# EAGLE design Lipo 18650 Boost Charge Protect (EAGLE 8.6.1)
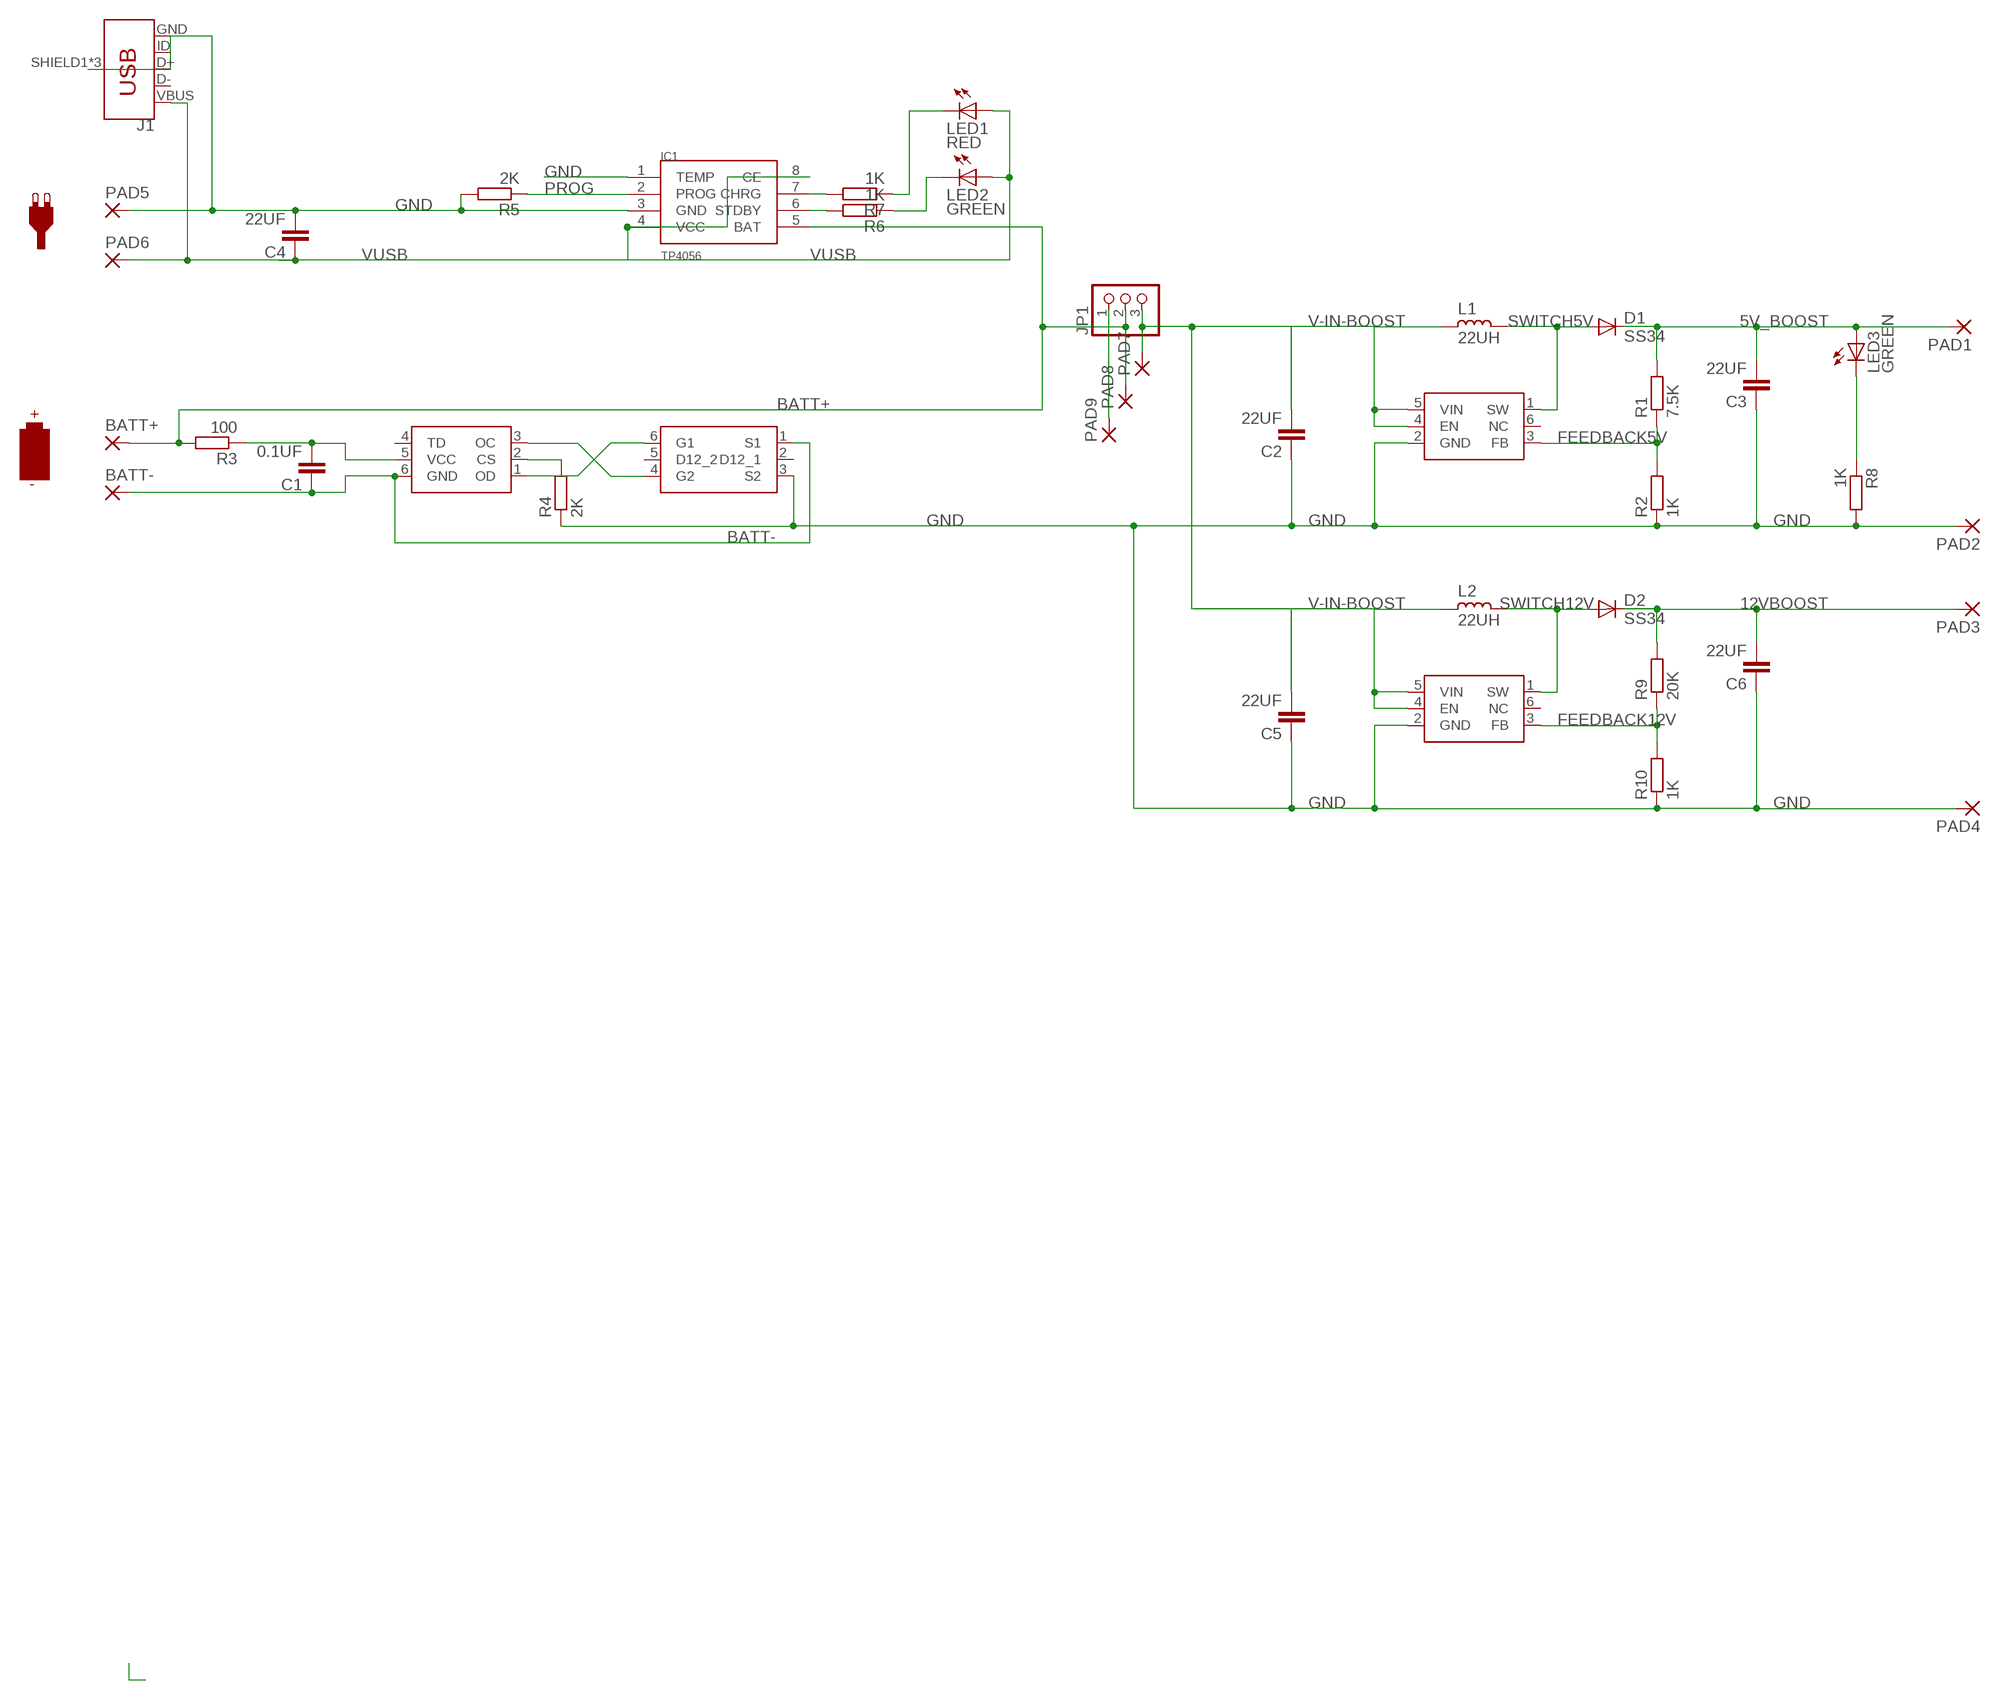
[diagram p0: schematic, sheet 1]

## Parts
BATT+  3,81/1,4  [3,81/1,4]
BATT-  3,81/1,4  [3,81/1,4]
C1  0.1UF  C-EUC1206  [C1206@1]
C2  22UF  C-EUC1812K  [C1812K@1]
C3  22UF  C-EUC1812K  [C1812K@1]
C4  22UF  C-EUC1812K  [C1812K@1]
C5  22UF  C-EUC1812K  [C1812K@1]
C6  22UF  C-EUC1812K  [C1812K@1]
D1  SS34  DIODE-DO-214AC  [DO-214AC]
D2  SS34  DIODE-DO-214AC  [DO-214AC]
IC1  TP4056  [SOP-8]
J1  USB_MICRO-B_FEMALE-SMT  [USB-B-MICRO-SMD]
JP1  PINHD-1X3CB  [1X03-CLEANBIG]
L1  22UH  L_CD75  [CD75]
L2  22UH  L_CD75  [CD75]
LED1  RED  LEDCHIPLED_0805  [CHIPLED_0805]
LED2  GREEN  LEDCHIPLED_0805  [CHIPLED_0805]
LED3  GREEN  LEDCHIPLED_0805  [CHIPLED_0805]
PAD1  SMD5  [SMD2,54-5,08]
PAD2  SMD5  [SMD2,54-5,08]
PAD3  SMD5  [SMD2,54-5,08]
PAD4  SMD5  [SMD2,54-5,08]
PAD5  SMD2  [SMD1,27-2,54]
PAD6  SMD2  [SMD1,27-2,54]
PAD7  SMD2  [SMD1,27-2,54]
PAD8  SMD2  [SMD1,27-2,54]
PAD9  SMD2  [SMD1,27-2,54]
R1  7.5K  R-EU_R1206  [R1206]
R2  1K  R-EU_R1206  [R1206]
R3  100  R-EU_R1206  [R1206]
R4  2K  R-EU_R1206  [R1206]
R5  2K  R-EU_R1206  [R1206]
R6  1K  R-EU_R0603  [R0603]
R7  1K  R-EU_R0603  [R0603]
R8  1K  R-EU_R1206  [R1206]
R9  20K  R-EU_R1206  [R1206]
R10  1K  R-EU_R1206  [R1206]
U$1  FS312F-G  [SOT23-6]
U$2  FS8205  [SOT23-6]
U$3  MT3608  [SOT23-6]
U$4  MT3608  [SOT23-6]

## Nets
5V_BOOST: C3.2 D1.1(C) LED3.A PAD1.1(P) R1.2
12VBOOST: C6.2 D2.1(C) PAD3.1(P) R9.2
BATT+: BATT+.1(P) IC1.5(BAT) JP1.2 PAD8.1(P) R3.2
BATT-: BATT-.1(P) C1.1 U$1.6(GND) U$2.1(S1)
CHG: IC1.7(CHRG) R7.2
FEEDBACK5V: R1.1 R2.2 U$3.3(FB)
FEEDBACK12V: R9.1 R10.2 U$4.3(FB)
GND: C2.1 C3.1 C4.2 C5.1 C6.1 IC1.1(TEMP) IC1.3(GND) J1.GND J1.SHIELD1(SHIELD) J1.SHIELD2(SHIELD) J1.SHIELD3(SHIELD) PAD2.1(P) PAD4.1(P) PAD5.1(P) R2.1 R4.1 R5.2 R8.2 R10.1 U$2.3(S2) U$3.2(GND) U$4.2(GND)
LEDCHR: LED1.C R7.1
LEDSBY: LED2.C R6.1
N$1: R4.2 U$1.2(CS)
N$2: JP1.1 PAD9.1(P)
N$7: LED3.C R8.1
OC: U$1.3(OC) U$2.4(G2)
OD: U$1.1(OD) U$2.6(G1)
PROG: IC1.2(PROG) R5.1
STANDBY: IC1.6(STDBY) R6.2
SWITCH5V: D1.2(A) L1.1 U$3.1(SW)
SWITCH12V: D2.2(A) L2.1 U$4.1(SW)
V-IN-BOOST: C2.2 C5.2 JP1.3 L1.2 L2.2 PAD7.1(P) U$3.4(EN) U$3.5(VIN) U$4.4(EN) U$4.5(VIN)
VCC-PROT: C1.2 R3.1 U$1.5(VCC)
VUSB: C4.1 IC1.4(VCC) IC1.8(CE) J1.VBUS LED1.A LED2.A PAD6.1(P)
Unconnected: J1.D+ J1.D- J1.ID U$1.4(TD) U$2.2(D12_1) U$2.5(D12_2) U$3.6(NC) U$4.6(NC)

## Notes on the sheet
- +
- -

## Library data of the parts
BATT+ BATT- = wirepad:3,81/1,4: THROUGH-HOLE PAD
C1-C6 = rcl:C-EU: CAPACITOR, European symbol
D1 D2 = dp_devices:DIODE: Various Diode Packages
IC1 = TP4056:TP4056
J1 = SparkFun-Connectors:USB_MICRO-B: USB Type Micro-B Connector Male/female and PTH/SMT variants SparkFun Products: SparkFun microB USB Breakout <https://www.sparkfun.com/products/12035> SparkFun USB microB Plug Breakout <https://www.sparkfun.com/products/10031> SparkFun ESP8266 Thing <https://www.sparkfun.com/products/13231>; PROD_ID: CONN-11752
JP1 = adafruit:PINHD-1X3: PIN HEADER
L1 L2 = rc-master-smd:L_: INDUCTOR
LED1-LED3 = led:LED: LED OSRAM: - CHIPLED LG R971, LG N971, LY N971, LG Q971, LY Q971, LO R971, LY R971 LH N974, LH R974 LS Q976, LO Q976, LY Q976 LO Q996 - Hyper CHIPLED LW Q18S LB Q993, LB Q99A, LB R99A - SideLED LS A670, LO A670, LY A670, LG A670, LP A670 LB A673, LV A673, LT A673, LW A673 LH A674 LY A675 LS A676, LA A676, LO A676, LY A676, LW A676 LS A679, LY A679, LG A679 - Hyper Micro SIDELED® LS Y876, LA Y876, LO Y876, LY Y876 LT Y87S - SmartLED LW L88C, LW L88S LB L89C, LB L89S, LG L890 LS L89K, LO L89K, LY L89K LS L896, LA L896, LO L896, LY L896 - TOPLED LS T670, LO T670, LY T670, LG T670, LP T670 LSG T670, LSP T670, LSY T670, LOP T670, LYG T670 LG T671, LOG T671, LSG T671 LB T673, LV T673, LT T673, LW T673 LH T674 LS T676, LA T676, LO T676, LY T676, LB T676, LH T676, LSB T676, LW T676 LB T67C, LV T67C, LT T67C, LS T67K, LO T67K, LY T67K, LW E67C LS E67B, LA E67B, LO E67B, LY E67B, LB E67C, LV E67C, LT E67C LW T67C LS T679, LY T679, LG T679 LS T770, LO T770, LY T770, LG T770, LP T770 LB T773, LV T773, LT T773, LW T773 LH T774 LS E675, LA E675, LY E675, LS T675 LS T776, LA T776, LO T776, LY T776, LB T776 LHGB T686 LT T68C, LB T68C - Hyper Mini TOPLED® LB M676 - Mini TOPLED Santana® LG M470 LS M47K, LO M47K, LY M47K Source: http://www.osram.convergy.de LUXEON: - LUMILED® LXK2-PW12-R00, LXK2-PW12-S00, LXK2-PW14-U00, LXK2-PW14-V00 LXK2-PM12-R00, LXK2-PM12-S00, LXK2-PM14-U00 LXK2-PE12-Q00, LXK2-PE12-R00, LXK2-PE12-S00, LXK2-PE14-T00, LXK2-PE14-U00 LXK2-PB12-K00, LXK2-PB12-L00, LXK2-PB12-M00, LXK2-PB14-N00, LXK2-PB14-P00, LXK2-PB14-Q00 LXK2-PR12-L00, LXK2-PR12-M00, LXK2-PR14-Q00, LXK2-PR14-R00 LXK2-PD12-Q00, LXK2-PD12-R00, LXK2-PD12-S00 LXK2-PH12-R00, LXK2-PH12-S00 LXK2-PL12-P00, LXK2-PL12-Q00, LXK2-PL12-R00 Source: www.luxeon.com KINGBRIGHT: KA-3528ASYC Source: www.kingbright.com
PAD1-PAD4 = wirepad:SMD5: SMD PAD
PAD5-PAD9 = wirepad:SMD2: SMD PAD
R1-R10 = rcl:R-EU_: RESISTOR, European symbol
U$1 = buckboost:FS312F-G
U$2 = buckboost:FS8205
U$3 U$4 = buckboost:MT3608

## Net classes
0 default: width 0.254 mm, clearance 0.254 mm

## Board
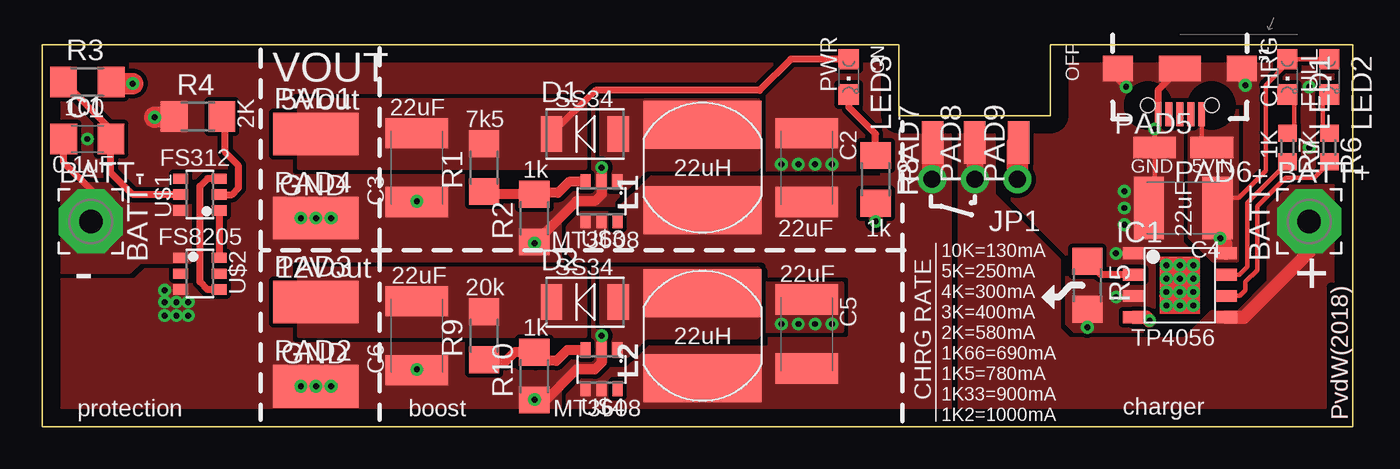
[diagram p1: board, top side]
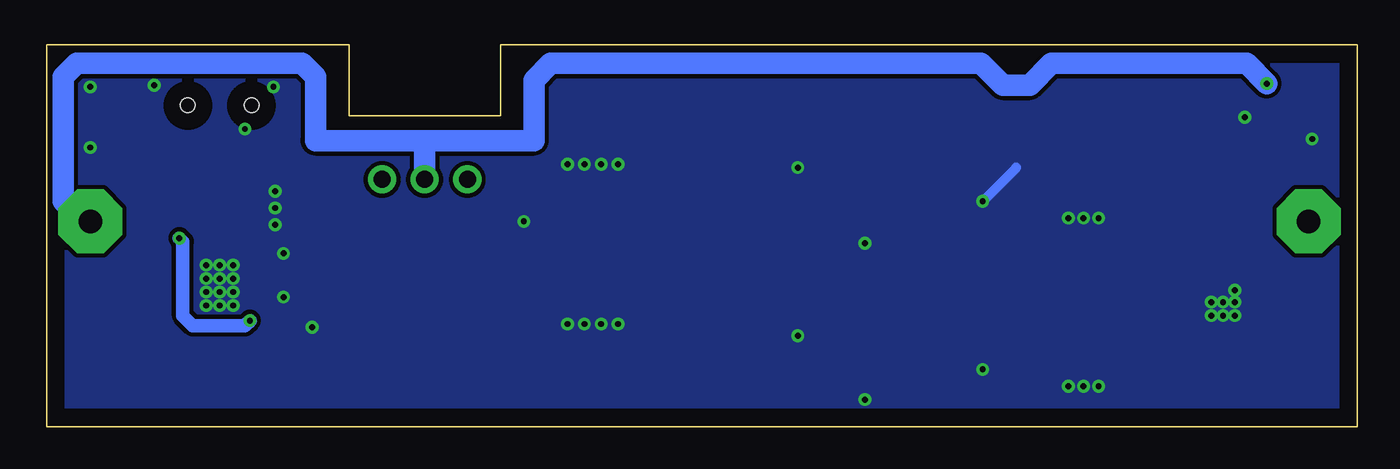
[diagram p2: board, bottom side, seen from below]

Size 78 x 22.7 mm. Coordinates in mm from the lower left corner, seen from the top.
Outline: 0,0 78,0 78,22.7 60,22.7 60,18.5 51,18.5 51,22.7 0,22.7 0,0
Copper layers (1*16): Top 0.035mm / dielectric 1.5mm / Bottom 0.035mm
Design rules "default": minimum track width 6mil, minimum drill 0.35mm, track to track 6mil, track to pad 6mil, pad to pad 6mil, via to via 6mil, smd to smd 6mil, copper to edge 40mil, drill to drill 6mil, minimum pad ring 10mil, minimum via ring 8mil, stop-mask expansion 4mil, vias tented up to drill 0mil, thermal gap 10mil

### Footprints (pad centres in the part's own frame; a part is rotated, then mirrored left to right if it is on the bottom)
3,81/1,4 = drill 1.397 pad 3.81 octagon: 1 0,0
C1206@1 = smd 1.6 x 1.8: 1 -1.4,0; 2 1.4,0
C1812K@1 = smd 1.8 x 3.7: 1 -2.05,0; 2 2.05,0
DO-214AC = smd 1.27 x 2.1: 1 -1.98,0; 2 1.98,0
SOP-8 = smd 1.3 x 0.7: 1 -2.75,1.905; 2 -2.75,0.635; 3 -2.75,-0.635; 4 -2.75,-1.905; 5 2.75,-1.905; 6 2.75,-0.635; 7 2.75,0.635; 8 2.75,1.905
USB-B-MICRO-SMD = smd 1.45 x 0.4: D+ 2.725,0; D- 2.725,0.65; GND 2.725,-1.3; ID 2.725,-0.65; VBUS 2.725,1.3 | smd 1.5 x 1.8: SHIELD1 0,3.685; SHIELD2 0,-3.685 | smd 1.5 x 2.5: SHIELD3 0,0 | hole 0.85: 2.2,1.9; 2.2,-1.9
1X03-CLEANBIG = drill 1.016 pad 1.676: 1 -2.54,0; 2 0,0; 3 2.54,0
CD75 = smd 7 x 2.85: 1 0,2.54; 2 0,-2.54
CHIPLED_0805 = smd 1.2 x 1.2: A 0,-1.05; C 0,1.05
SMD2,54-5,08 = smd 2.54 x 5.08: 1 0,0
SMD1,27-2,54 = smd 1.27 x 2.54: 1 0,0
R1206 = smd 1.6 x 1.803: 1 -1.422,0; 2 1.422,0
R0603 = smd 1 x 1.1: 1 -0.85,0; 2 0.85,0
SOT23-6 = smd 0.6 x 0.9: 1 -0.95,-1.15; 2 0,-1.15; 3 0.95,-1.15; 4 0.95,1.15; 5 0,1.15; 6 -0.95,1.15

### Placement (x,y rotation side)
BATT+  75.4,12.2 0 top
BATT-  2.9,12.2 0 top
C1  2.7,17.1 0 top
C2  45.5,15.4 270 top
C3  22.3,15.4 90 top
C4  67.9,13 180 top
C5  45.5,5.5 270 top
C6  22.3,5.4 90 top
D1  32.3,17.4 0 top
D2  32.3,7.4 0 top
IC1  67.7,8.4 0 top
J1  67.7,21.3 270 top
JP1  55.5,14.7 180 top
L1  39.3,15.4 0 top
L2  39.3,5.4 0 top
LED1  74.1,20.8 180 top
LED2  76.6,20.8 180 top
LED3  48,20.8 180 top
PAD1  16.3,17.4 270 top
PAD2  16.3,2.4 270 top
PAD3  16.3,7.4 270 top
PAD4  16.3,12.4 270 top
PAD5  66.2,16.6 270 top
PAD6  69.6,16.6 90 top
PAD7  53,16.9 0 top
PAD8  55.5,16.9 0 top
PAD9  58.1,16.9 0 top
R1  26.3,15.4 90 top
R2  29.3,12.4 90 top
R3  2.7,20.5 0 top
R4  9.28,18.44 0 top
R5  62.2,8.4 270 top
R6  76.6,16.6 270 top
R7  74.1,16.6 270 top
R8  49.6,14.7 270 top
R9  26.3,5.4 90 top
R10  29.3,3 90 top
U$1  9.4,13.8 90 top
U$2  9.4,9.1 270 top
U$3  33.3,13.4 180 top
U$4  33.3,3.4 180 top

### Tracks (layer width: path | path; a pad name or v marks a point on that pad's centre or on a via)
5V_BOOST
  Top 0.406: LED3.A 44.55,21.85 42.7,20 32.92,20 D1.1
  pour Top (rank 3, no thermals): 32.3,15.4 32.3,19.4 15.3,19.4 15.3,15.4
12VBOOST
  pour Top (rank 3, no thermals): 32.3,5.4 32.3,9.4 15.3,9.4 15.3,5.4
BATT+  (via drill 0.35)
  Top 0.406: R3.2 4.1,20.5
  Top 0.813: IC1.5 71.5,6.5 75.4,10.4 BATT+.1
  Top 1.016: PAD8.1 JP1.2
  Top 1.27: v5.4,20.4 4.2,20.4 4.1,20.5
  Bottom 1.016: 55,17 55.5,16.5
  Bottom 1.27: BATT+.1 75.8,12.2 77,13.4 77,20.8 76.2,21.6 62.8,21.6 62,20.8 62,17 55,17 49,17 49,20.6 48,21.6 22.4,21.6 21.1,20.3 19.5,20.3 18.2,21.6 6.6,21.6 v5.4,20.4 | 55.5,16.5 JP1.2
  pour Top (rank 4, no thermals): 54.6,18.1 54.6,0.4 77.6,0.4 77.6,13.6 76.9,14.3 74.3,14.3 73,13 73,8.6 71.2,6.8 69.6,6.8 68,5.2 61.1,5.2 60.5,5.8 60.5,9.9 56.6,13.8 56.6,18.1
BATT-
  Top 0.406: BATT-.1 2.9,14.1 1.3,15.7 C1.1
  pour Top (rank 2, no thermals): 8.8,13.2 5.1,13.2 3.9,14.4 0.4,14.4 0.3,14.3 0.3,9.2 5.2,9.2 5.8,9.8 8.8,9.8
CHG
  Top 0.254: IC1.7 71.23,9.04 71.7,9.5 71.7,13.3 74.1,15.7 R7.2
FEEDBACK5V
  Top 0.61: U$3.3 31.35,14.55 30.7,13.9 29.38,13.9 R2.2 27.08,13.82 26.9,14 26.32,14 R1.1
FEEDBACK12V
  Top 0.61: U$4.3 31.25,4.55 30.6,3.9 29.38,3.9 R10.2 28.12,4.42 27.6,3.9 26.6,3.9 26.46,3.82 R9.1
GND  (via drill 0.35)
  Top 0.254: 64.9,10.36 IC1.1 | v66.2,17.7 PAD5.1 66.2,13.85 C4.2
  Top 0.406: 66.67,7.76 v66.9,8 | J1.SHIELD2 64.02,20.68 v64.5,20.2 | J1.SHIELD1 71.39,20.52 v71.6,20.3 | J1.SHIELD3 66.4,20 J1.GND 66.4,17.9 v66.2,17.7 | R8.2 v49.6,12.2
  Top 0.61: v33.3,5.4 U$4.2 33.3,3.8 32.9,3.4 31.8,3.4 29.8,1.4 | v33.3,15.4 U$3.2 33.3,13.8 32.9,13.4 31.8,13.4 29.8,11.4
  Top 1.27: R4.1 7.46,18.44 v6.7,18.4
  Bottom 0.61: 20.3,15.4 v22.3,13.4
  other vias: 68.5,9.6 67.7,9.6 66.9,8.8 67.7,8.8 68.5,8.8 68.5,8 67.7,8 66.9,7.2 67.7,7.2 68.5,7.2 47,6.1 46,6.1 45,6.1 44,6.1 46,15.6 45,15.6 44,15.6 47,15.6 16.3,2.4 22.3,3.4 29.3,1.6 16.3,12.4 29.3,10.9 8,7.4 7.3,8.1 7.3,7.4 8.7,7.4 62.2,5.9 64.4,13 64.4,14 64.4,12 66.9,9.6 63.9,10.3 63.9,7.7 8,6.6 8.7,6.6 7.3,6.6 2.7,17.1 75.4,20.2 17.2,12.4 15.4,12.4 17.2,2.4 15.4,2.4 75.4,16.6
  pour Top (no thermals): 47.6,5.7 47.6,8.5 43.4,8.5 43.4,5.7
  pour Bottom (rank 2, no thermals): 78,0 78,22.6 77.9,22.7 60,22.7 60,18.5 51,18.5 51,22.7 0.1,22.7 0,22.6 0,0.1 0.1,0
  pour Top (no thermals): 8.9,6.9 8.9,8.5 6.8,8.5 6.8,6.9
  pour Top (rank 6, no thermals): 78,0 78,22.6 77.9,22.7 60,22.7 60,18.5 51,18.5 51,22.7 0.1,22.7 0,22.6 0,0.1 0.1,0
LEDCHR
  Top 0.254: R7.1 74.45,17.8 74.5,17.8 74.5,19.35 LED1.C
LEDSBY
  Top 0.254: R6.1 76.25,17.8 76.2,17.8 76.2,19.35 LED2.C
N$1
  Top 0.406: U$1.2 11.3,13.8 11.7,14.2 11.7,15.5 10.9,16.3 10.9,18.24 R4.2
N$2
  Top 1.016: PAD9.1 58.04,16.84
  Top 1.27: 58.04,16.84 JP1.1
N$7
  Top 0.406: R8.1 49.6,17.4 48,19 LED3.C
OC
  Top 0.406: U$1.3 9.85,14.75 9.4,14.3 9.4,8.6 9.85,8.15 U$2.4
OD
  Top 0.406: U$1.1 U$2.6
PROG
  Top 0.406: IC1.2 62.99,9.04 R5.1
STANDBY
  Top 0.254: IC1.6 71.27,7.76 71.6,8.1 71.6,8.6 72.3,9.3 72.3,13.1 74,14.8 75.7,14.8 76.6,15.7 R6.2
SWITCH5V
  pour Top (no thermals): 34,14.2 34.8,14.2 35.9,15.3 42.5,15.3 42.7,15.5 42.7,19.3 42.6,19.4 33.3,19.4 33.3,16.1 33.9,15.5 33.9,14.3
SWITCH12V
  pour Top (no thermals): 34,4.2 34.8,4.2 35.9,5.3 42.5,5.3 42.7,5.5 42.7,9.3 42.6,9.4 33.3,9.4 33.3,6.1 33.9,5.5 33.9,4.3
V-IN-BOOST
  Top 1.016: 53,14.74 JP1.3
  Top 1.27: PAD7.1 53,14.74
  pour Top (rank 2, no thermals): 31.3,0.4 54,0.4 54,18.3 50,18.3 50,14.8 36.2,14.8 34.1,12.7 32.1,12.7 31.3,11.9 31.3,10.4 31.8,9.9 42.8,9.9 43.3,9.4 43.3,4.7 36.1,4.7 34.8,3.4 31.3,3.4
VCC-PROT
  Top 0.406: U$1.5 5.4,13.8 4.1,15.1 C1.2 4.1,17.68 R3.1
VUSB  (via drill 0.35)
  Top 0.254: 74.1,21.5 74.1,21.6 | LED2.A LED1.A 74.1,21.6 | 74.1,21.6 72.8,20.3 72.8,15.2 71.2,13.6 70.05,13.6 C4.1 | J1.VBUS 69,17.2 PAD6.1
  Top 0.813: IC1.4 65.7,6.5 v65.9,6.3 | C4.1 70.1,13.35 v70.1,11.2 70.45,10.85 IC1.8
  Bottom 0.813: v65.9,6.3 66.2,6 69.3,6 69.9,6.6 69.9,11 v70.1,11.2
  pour Top (rank 2, no thermals): 68.7,19.6 68.7,17.8 68.3,17.4 68.3,11.3 69.7,9.9 71.1,9.9 71.1,19.6

### Text on the board
Top: PvdW(2018)
tPlace: ON | OFF | 2K | VOUT | 5Vout | PWR | SS34 | CHRG | FULL | 100 | 22uF | 7k5 | FS312 | GND | 1K | 1K | 0.1uF | GND | 1k | 22uH | 5VIN | BATT+ | FS8205 | MT3608 | 22uF | 1k | 22uF | BATT- | 12Vout | SS34 | 22uF | - | 22uF | 20k | + | GND | 1k | 22uH | TP4056 | CHRG RATE | protection | boost | MT3608 | charger | PvdW(2018) | 10K=130mA / 5K=250mA / 4K=300mA / 3K=400mA / 2K=580mA / 1K66=690mA / 1K5=780mA / 1K33=900mA / 1K2=1000mA